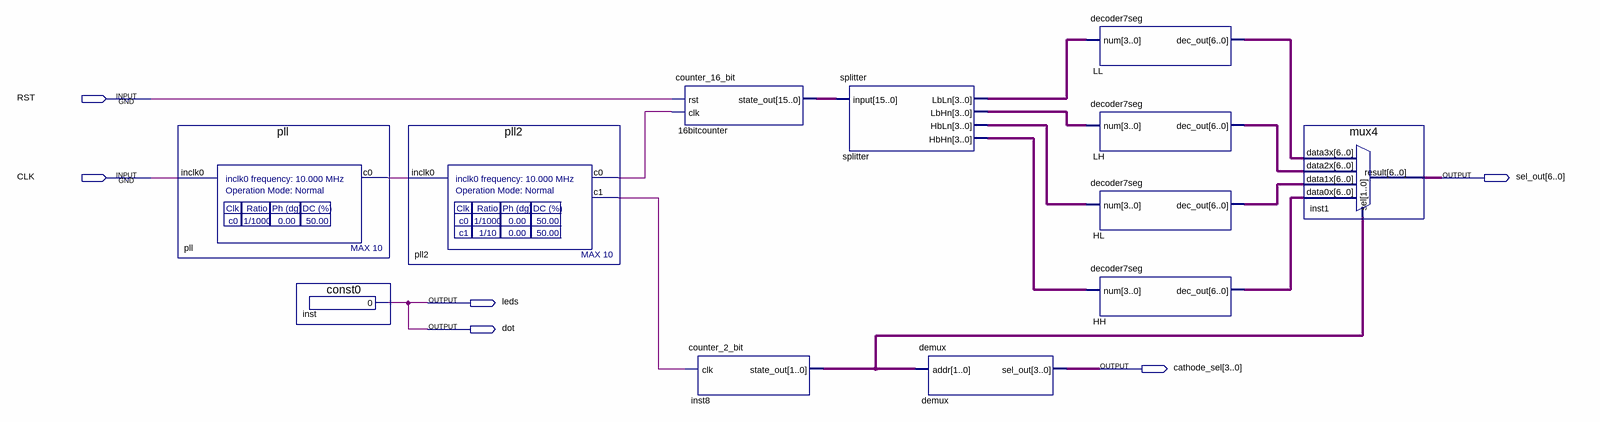
[diagram p0: schematic sheet]
// Quartus schematic counter16bit_top.bdf as structural Verilog: 12 symbols, 6 pins
module counter16bit_top (
  input  RST,
  input  CLK,
  output [6:0] sel_out,
  output leds,
  output dot,
  output [3:0] cathode_sel
);

  wire pll2_c0, pll2_c1, pll_c0;
  wire [1:0] inst8_state_out;
  wire [3:0] splitter_hbhn, splitter_hbln, splitter_lbhn, splitter_lbln;
  wire [6:0] HH_dec_out, HL_dec_out, LH_dec_out, LL_dec_out;
  wire [15:0] n16bitcounter_state_out;

  pll pll (.inclk0(CLK), .c0(pll_c0));
  const0 inst (.result(dot));
  pll2 pll2 (.inclk0(pll_c0), .c0(pll2_c0), .c1(pll2_c1));
  counter_16_bit u_16bitcounter (.rst(RST), .clk(pll2_c0), .state_out(n16bitcounter_state_out));
  counter_2_bit inst8 (.clk(pll2_c1), .state_out(inst8_state_out));
  splitter splitter (
    .\input (n16bitcounter_state_out), .LbLn(splitter_lbln), .LbHn(splitter_lbhn), .HbLn(splitter_hbln),
    .HbHn(splitter_hbhn));
  demux demux (.addr(inst8_state_out), .sel_out(cathode_sel));
  decoder7seg LL (.num(splitter_lbln), .dec_out(LL_dec_out));
  decoder7seg LH (.num(splitter_lbhn), .dec_out(LH_dec_out));
  decoder7seg HL (.num(splitter_hbln), .dec_out(HL_dec_out));
  decoder7seg HH (.num(splitter_hbhn), .dec_out(HH_dec_out));
  mux4 inst1 (
    .data3x(LL_dec_out), .data2x(LH_dec_out), .data1x(HL_dec_out), .data0x(HH_dec_out),
    .sel(inst8_state_out), .result(sel_out));

  assign leds = dot;
endmodule
